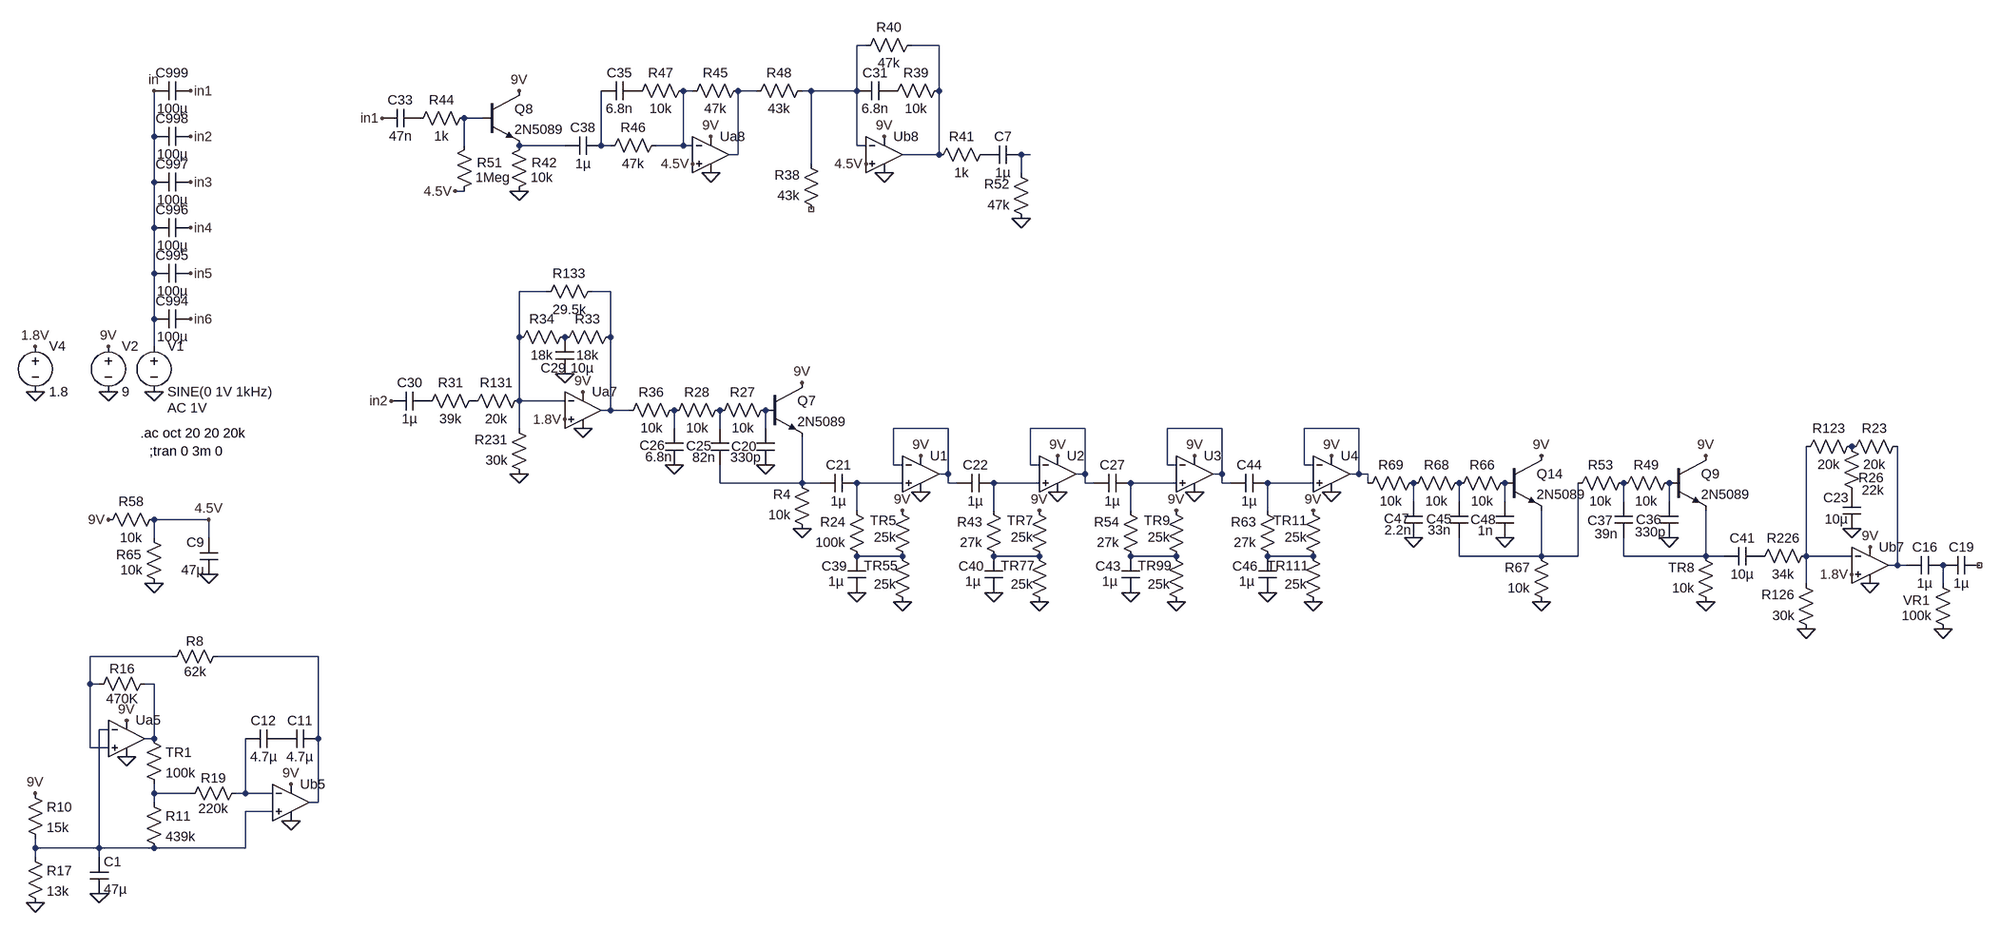
[diagram p0: schematic carbon_copy.asc]
carbon_copy.asc, the LTspice schematic file:
Version 4
SHEET 1 3200 3556
WIRE -320 544 -336 544
WIRE -192 544 -240 544
WIRE -624 624 -640 624
WIRE -512 624 -544 624
WIRE -416 624 -432 624
WIRE -336 624 -336 544
WIRE -336 624 -416 624
WIRE -192 624 -192 544
WIRE -992 672 -1024 672
WIRE -1568 704 -1568 624
WIRE -1024 720 -1024 672
WIRE -848 720 -928 720
WIRE -784 720 -784 624
WIRE -768 720 -784 720
WIRE -640 720 -640 624
WIRE -640 720 -688 720
WIRE -624 720 -640 720
WIRE -336 720 -336 624
WIRE -320 720 -336 720
WIRE -544 736 -544 624
WIRE -544 736 -560 736
WIRE -192 736 -192 624
WIRE -192 736 -256 736
WIRE -32 736 -48 736
WIRE -416 752 -416 624
WIRE -48 768 -48 736
WIRE -1568 784 -1568 704
WIRE -1024 800 -1040 800
WIRE -1568 864 -1568 784
WIRE -1568 944 -1568 864
WIRE -880 976 -928 976
WIRE -768 976 -800 976
WIRE -1568 1024 -1568 944
WIRE -928 1056 -928 976
WIRE -768 1056 -768 976
WIRE -1568 1072 -1568 1024
WIRE -928 1168 -928 1056
WIRE -848 1168 -928 1168
WIRE -768 1184 -768 1056
WIRE -768 1184 -784 1184
WIRE -736 1184 -768 1184
WIRE -928 1216 -928 1168
WIRE -656 1216 -656 1184
WIRE -576 1216 -576 1184
WIRE -496 1216 -496 1184
WIRE -176 1216 -272 1216
WIRE 64 1216 -32 1216
WIRE 304 1216 208 1216
WIRE 544 1216 448 1216
WIRE -272 1280 -272 1216
WIRE -256 1280 -272 1280
WIRE -32 1280 -32 1216
WIRE -16 1280 -32 1280
WIRE 208 1280 208 1216
WIRE 224 1280 208 1280
WIRE 448 1280 448 1216
WIRE 464 1280 448 1280
WIRE -176 1296 -176 1216
WIRE -176 1296 -192 1296
WIRE 64 1296 64 1216
WIRE 64 1296 48 1296
WIRE 304 1296 304 1216
WIRE 304 1296 288 1296
WIRE 544 1296 544 1216
WIRE 544 1296 528 1296
WIRE 560 1296 544 1296
WIRE -576 1312 -576 1280
WIRE -432 1312 -432 1232
WIRE -432 1312 -576 1312
WIRE -400 1312 -432 1312
WIRE -256 1312 -336 1312
WIRE -176 1312 -176 1296
WIRE -160 1312 -176 1312
WIRE -16 1312 -96 1312
WIRE 64 1312 64 1296
WIRE 80 1312 64 1312
WIRE 224 1312 144 1312
WIRE 304 1312 304 1296
WIRE 320 1312 304 1312
WIRE 464 1312 384 1312
WIRE 560 1312 560 1296
WIRE 640 1344 640 1312
WIRE 720 1344 720 1312
WIRE 800 1344 800 1312
WIRE 1008 1344 1008 1312
WIRE 1088 1344 1088 1312
WIRE -336 1360 -336 1312
WIRE -96 1360 -96 1312
WIRE 144 1360 144 1312
WIRE 384 1360 384 1312
WIRE -1472 1376 -1568 1376
WIRE -1568 1408 -1568 1376
WIRE -1472 1408 -1472 1376
WIRE -256 1440 -336 1440
WIRE -16 1440 -96 1440
WIRE 224 1440 144 1440
WIRE 464 1440 384 1440
WIRE 720 1440 720 1408
WIRE 864 1440 864 1360
WIRE 864 1440 720 1440
WIRE 928 1440 928 1312
WIRE 928 1440 864 1440
WIRE 1008 1440 1008 1408
WIRE 1152 1440 1152 1360
WIRE 1152 1440 1008 1440
WIRE 1184 1440 1152 1440
WIRE 1328 1440 1328 1248
WIRE 1408 1440 1328 1440
WIRE 1488 1456 1488 1248
WIRE 1488 1456 1472 1456
WIRE 1504 1456 1488 1456
WIRE 1328 1488 1328 1440
WIRE 1568 1488 1568 1456
WIRE -1536 1616 -1680 1616
WIRE -1280 1616 -1456 1616
WIRE -1680 1664 -1680 1616
WIRE -1664 1664 -1680 1664
WIRE -1568 1664 -1584 1664
WIRE -1648 1744 -1664 1744
WIRE -1568 1760 -1568 1664
WIRE -1568 1760 -1584 1760
WIRE -1280 1760 -1280 1616
WIRE -1680 1776 -1680 1664
WIRE -1648 1776 -1680 1776
WIRE -1568 1856 -1568 1840
WIRE -1504 1856 -1568 1856
WIRE -1408 1856 -1408 1760
WIRE -1408 1856 -1424 1856
WIRE -1360 1856 -1408 1856
WIRE -1568 1872 -1568 1856
WIRE -1280 1872 -1280 1760
WIRE -1280 1872 -1296 1872
WIRE -1360 1888 -1408 1888
WIRE -1776 1952 -1776 1936
WIRE -1664 1952 -1664 1744
WIRE -1664 1952 -1776 1952
WIRE -1568 1952 -1664 1952
WIRE -1408 1952 -1408 1888
WIRE -1408 1952 -1568 1952
WIRE -1776 1968 -1776 1952
WIRE -1664 1968 -1664 1952
FLAG -1568 1152 0
FLAG -1568 624 in
FLAG -1648 1152 0
FLAG -1648 1072 9V
FLAG -1504 624 in1
FLAG -1504 704 in2
FLAG -1504 784 in3
FLAG -1504 864 in4
FLAG -1504 944 in5
FLAG -1504 1024 in6
FLAG -1648 1376 9V
FLAG -1568 1488 0
FLAG -1472 1472 0
FLAG -1472 1376 4.5V
FLAG -1776 2048 0
FLAG -1328 1904 0
FLAG -1616 1792 0
FLAG -1664 2032 0
FLAG -1616 1728 9V
FLAG -1328 1840 9V
FLAG -1776 1856 9V
FLAG -816 1152 9V
FLAG -816 1216 0
FLAG -928 1296 0
FLAG -848 1120 0
FLAG -1776 1152 0
FLAG -1776 1072 1.8V
FLAG -848 1200 1.8V
FLAG -1040 800 4.5V
FLAG -928 800 0
FLAG -928 624 9V
FLAG -624 752 4.5V
FLAG -592 704 9V
FLAG -592 768 0
FLAG -320 752 4.5V
FLAG -288 704 9V
FLAG -288 768 0
FLAG -48 848 0
FLAG -1168 672 in1
FLAG -1152 1168 in2
FLAG -432 1136 9V
FLAG -496 1280 0
FLAG -656 1280 0
FLAG -432 1392 0
FLAG -336 1504 0
FLAG -256 1520 0
FLAG -256 1360 9V
FLAG -224 1328 0
FLAG -224 1264 9V
FLAG -96 1504 0
FLAG -16 1520 0
FLAG -16 1360 9V
FLAG 16 1328 0
FLAG 16 1264 9V
FLAG 144 1504 0
FLAG 224 1520 0
FLAG 224 1360 9V
FLAG 256 1328 0
FLAG 256 1264 9V
FLAG 384 1504 0
FLAG 464 1520 0
FLAG 464 1360 9V
FLAG 496 1328 0
FLAG 496 1264 9V
FLAG 864 1264 9V
FLAG 800 1408 0
FLAG 640 1408 0
FLAG 864 1520 0
FLAG 1152 1264 9V
FLAG 1088 1408 0
FLAG 1152 1520 0
FLAG 1440 1424 9V
FLAG 1440 1488 0
FLAG 1328 1568 0
FLAG 1408 1472 1.8V
FLAG 1408 1392 0
FLAG 1568 1568 0
SYMBOL voltage -1568 1056 R0
WINDOW 123 24 124 Left 2
WINDOW 39 0 0 Left 2
SYMATTR Value2 AC 1V
SYMATTR InstName V1
SYMATTR Value SINE(0 1V 1kHz)
SYMBOL voltage -1648 1056 R0
WINDOW 123 0 0 Left 0
WINDOW 39 0 0 Left 0
SYMATTR InstName V2
SYMATTR Value 9
SYMBOL cap -1504 688 R90
WINDOW 0 0 32 VBottom 2
WINDOW 3 32 32 VTop 2
SYMATTR InstName C998
SYMATTR Value 100µ
SYMBOL cap -1504 768 R90
WINDOW 0 0 32 VBottom 2
WINDOW 3 32 32 VTop 2
SYMATTR InstName C997
SYMATTR Value 100µ
SYMBOL cap -1504 848 R90
WINDOW 0 0 32 VBottom 2
WINDOW 3 32 32 VTop 2
SYMATTR InstName C996
SYMATTR Value 100µ
SYMBOL cap -1504 608 R90
WINDOW 0 0 32 VBottom 2
WINDOW 3 32 32 VTop 2
SYMATTR InstName C999
SYMATTR Value 100µ
SYMBOL cap -1504 928 R90
WINDOW 0 0 32 VBottom 2
WINDOW 3 32 32 VTop 2
SYMATTR InstName C995
SYMATTR Value 100µ
SYMBOL cap -1504 1008 R90
WINDOW 0 0 32 VBottom 2
WINDOW 3 32 32 VTop 2
SYMATTR InstName C994
SYMATTR Value 100µ
SYMBOL res -1552 1360 R90
WINDOW 0 0 56 VBottom 2
WINDOW 3 32 56 VTop 2
SYMATTR InstName R58
SYMATTR Value 10k
SYMBOL res -1552 1504 R180
WINDOW 0 38 66 Left 2
WINDOW 3 36 40 Left 2
SYMATTR InstName R65
SYMATTR Value 10k
SYMBOL cap -1456 1472 R180
WINDOW 0 24 56 Left 2
WINDOW 3 24 8 Left 2
SYMATTR InstName C9
SYMATTR Value 47µ
SYMBOL UniversalOpamp2 -1616 1760 R0
SYMATTR InstName Ua5
SYMATTR SpiceLine ilimit=70m rail=0 Vos=0 phimargin=45
SYMBOL res -1408 1840 R90
WINDOW 0 5 56 VBottom 2
WINDOW 3 27 56 VTop 2
SYMATTR InstName R19
SYMATTR Value 220k
SYMBOL res -1792 1840 R0
SYMATTR InstName R10
SYMATTR Value 15k
SYMBOL res -1792 1952 R0
SYMATTR InstName R17
SYMATTR Value 13k
SYMBOL res -1568 1648 R90
WINDOW 0 5 56 VBottom 2
WINDOW 3 27 56 VTop 2
SYMATTR InstName R16
SYMATTR Value 470K
SYMBOL UniversalOpamp2 -1328 1872 R0
SYMATTR InstName Ub5
SYMATTR SpiceLine ilimit=70m rail=0 Vos=0 phimargin=45
SYMBOL res -1440 1600 R90
WINDOW 0 5 56 VBottom 2
WINDOW 3 27 56 VTop 2
SYMATTR InstName R8
SYMATTR Value 62k
SYMBOL res -1584 1744 R0
SYMATTR InstName TR1
SYMATTR Value 100k
SYMBOL res -1584 1856 R0
SYMATTR InstName R11
SYMATTR Value 439k
SYMBOL cap -1680 2032 M180
WINDOW 0 24 56 Left 2
WINDOW 3 24 8 Left 2
SYMATTR InstName C1
SYMATTR Value 47µ
SYMBOL cap -1280 1744 R90
WINDOW 0 0 32 VBottom 2
WINDOW 3 32 32 VTop 2
SYMATTR InstName C11
SYMATTR Value 4.7µ
SYMBOL cap -1344 1744 R90
WINDOW 0 0 32 VBottom 2
WINDOW 3 32 32 VTop 2
SYMATTR InstName C12
SYMATTR Value 4.7µ
SYMBOL res -1024 1184 R270
WINDOW 0 32 56 VTop 2
WINDOW 3 0 56 VBottom 2
SYMATTR InstName R131
SYMATTR Value 20k
SYMBOL res -912 1312 R180
WINDOW 0 36 76 Left 2
WINDOW 3 36 40 Left 2
SYMATTR InstName R231
SYMATTR Value 30k
SYMBOL Opamps\\UniversalOpamp2 -816 1184 R0
SYMATTR InstName Ua7
SYMBOL cap -1088 1152 R90
WINDOW 0 0 32 VBottom 2
WINDOW 3 32 32 VTop 2
SYMATTR InstName C30
SYMATTR Value 1µ
SYMBOL res -992 1152 R90
WINDOW 0 0 56 VBottom 2
WINDOW 3 32 56 VTop 2
SYMATTR InstName R31
SYMATTR Value 39k
SYMBOL res -832 1040 R90
WINDOW 0 0 56 VBottom 2
WINDOW 3 32 56 VTop 2
SYMATTR InstName R34
SYMATTR Value 18k
SYMBOL res -752 1040 R90
WINDOW 0 0 56 VBottom 2
WINDOW 3 32 56 VTop 2
SYMATTR InstName R33
SYMATTR Value 18k
SYMBOL cap -864 1120 M180
WINDOW 0 -26 10 Left 2
WINDOW 3 26 10 Left 2
SYMATTR InstName C29
SYMATTR Value 10µ
SYMBOL voltage -1776 1056 R0
WINDOW 123 0 0 Left 0
WINDOW 39 0 0 Left 0
SYMATTR InstName V4
SYMATTR Value 1.8
SYMBOL cap -1104 656 R90
WINDOW 0 0 32 VBottom 2
WINDOW 3 32 32 VTop 2
SYMATTR InstName C33
SYMATTR Value 47n
SYMBOL res -1008 656 R90
WINDOW 0 0 56 VBottom 2
WINDOW 3 32 56 VTop 2
SYMATTR InstName R44
SYMATTR Value 1k
SYMBOL res -1040 816 M180
WINDOW 0 38 66 Left 2
WINDOW 3 36 40 Left 2
SYMATTR InstName R51
SYMATTR Value 1Meg
SYMBOL npn -992 624 R0
SYMATTR InstName Q8
SYMATTR Value 2N5089
SYMBOL res -944 816 M180
WINDOW 0 38 66 Left 2
WINDOW 3 36 40 Left 2
SYMATTR InstName R42
SYMATTR Value 10k
SYMBOL cap -784 704 R90
WINDOW 0 0 32 VBottom 2
WINDOW 3 32 32 VTop 2
SYMATTR InstName C38
SYMATTR Value 1µ
SYMBOL res -672 704 R90
WINDOW 0 0 56 VBottom 2
WINDOW 3 32 56 VTop 2
SYMATTR InstName R46
SYMATTR Value 47k
SYMBOL res -624 608 R90
WINDOW 0 0 56 VBottom 2
WINDOW 3 32 56 VTop 2
SYMATTR InstName R47
SYMATTR Value 10k
SYMBOL cap -720 608 R90
WINDOW 0 0 32 VBottom 2
WINDOW 3 32 32 VTop 2
SYMATTR InstName C35
SYMATTR Value 6.8n
SYMBOL Opamps\\UniversalOpamp2 -592 736 R0
SYMATTR InstName Ua8
SYMBOL res -528 608 R90
WINDOW 0 0 56 VBottom 2
WINDOW 3 32 56 VTop 2
SYMATTR InstName R45
SYMATTR Value 47k
SYMBOL res -416 608 R90
WINDOW 0 0 56 VBottom 2
WINDOW 3 32 56 VTop 2
SYMATTR InstName R48
SYMATTR Value 43k
SYMBOL Opamps\\UniversalOpamp2 -288 736 R0
SYMATTR InstName Ub8
SYMBOL res -400 848 R180
WINDOW 0 36 76 Left 2
WINDOW 3 36 40 Left 2
SYMATTR InstName R38
SYMATTR Value 43k
SYMBOL cap -272 608 R90
WINDOW 0 0 32 VBottom 2
WINDOW 3 32 32 VTop 2
SYMATTR InstName C31
SYMATTR Value 6.8n
SYMBOL res -176 608 R90
WINDOW 0 0 56 VBottom 2
WINDOW 3 32 56 VTop 2
SYMATTR InstName R39
SYMATTR Value 10k
SYMBOL res -224 528 R90
WINDOW 0 0 56 VBottom 2
WINDOW 3 32 56 VTop 2
SYMATTR InstName R40
SYMATTR Value 47k
SYMBOL res -96 720 R90
WINDOW 0 0 56 VBottom 2
WINDOW 3 32 56 VTop 2
SYMATTR InstName R41
SYMATTR Value 1k
SYMBOL cap -48 720 R90
WINDOW 0 0 32 VBottom 2
WINDOW 3 32 32 VTop 2
SYMATTR InstName C7
SYMATTR Value 1µ
SYMBOL res -32 864 R180
WINDOW 0 36 76 Left 2
WINDOW 3 36 40 Left 2
SYMATTR InstName R52
SYMATTR Value 47k
SYMBOL res -784 960 R90
WINDOW 0 0 56 VBottom 2
WINDOW 3 32 56 VTop 2
SYMATTR InstName R133
SYMATTR Value 29.5k
SYMBOL res -640 1168 R90
WINDOW 0 0 56 VBottom 2
WINDOW 3 32 56 VTop 2
SYMATTR InstName R36
SYMATTR Value 10k
SYMBOL cap -672 1280 M180
WINDOW 0 -45 34 Left 2
WINDOW 3 -35 14 Left 2
SYMATTR InstName C26
SYMATTR Value 6.8n
SYMBOL res -560 1168 R90
WINDOW 0 0 56 VBottom 2
WINDOW 3 32 56 VTop 2
SYMATTR InstName R28
SYMATTR Value 10k
SYMBOL cap -592 1280 M180
WINDOW 0 -43 33 Left 2
WINDOW 3 -32 13 Left 2
SYMATTR InstName C25
SYMATTR Value 82n
SYMBOL res -480 1168 R90
WINDOW 0 0 56 VBottom 2
WINDOW 3 32 56 VTop 2
SYMATTR InstName R27
SYMATTR Value 10k
SYMBOL cap -512 1280 M180
WINDOW 0 -44 32 Left 2
WINDOW 3 -46 13 Left 2
SYMATTR InstName C20
SYMATTR Value 330p
SYMBOL npn -496 1136 R0
SYMATTR InstName Q7
SYMATTR Value 2N5089
SYMBOL res -416 1408 R180
WINDOW 0 36 76 Left 2
WINDOW 3 36 40 Left 2
SYMATTR InstName R4
SYMATTR Value 10k
SYMBOL cap -336 1296 R90
WINDOW 0 0 32 VBottom 2
WINDOW 3 32 32 VTop 2
SYMATTR InstName C21
SYMATTR Value 1µ
SYMBOL res -320 1456 R180
WINDOW 0 36 76 Left 2
WINDOW 3 36 40 Left 2
SYMATTR InstName R24
SYMATTR Value 100k
SYMBOL cap -352 1504 M180
WINDOW 0 -46 46 Left 2
WINDOW 3 -34 20 Left 2
SYMATTR InstName C39
SYMATTR Value 1µ
SYMBOL res -240 1456 R180
WINDOW 0 27 78 Left 2
WINDOW 3 27 49 Left 2
SYMATTR InstName TR5
SYMATTR Value 25k
SYMBOL res -240 1536 R180
WINDOW 0 24 79 Left 2
WINDOW 3 27 47 Left 2
SYMATTR InstName TR55
SYMATTR Value 25k
SYMBOL Opamps\\UniversalOpamp2 -224 1296 R0
SYMATTR InstName U1
SYMBOL cap -96 1296 R90
WINDOW 0 0 32 VBottom 2
WINDOW 3 32 32 VTop 2
SYMATTR InstName C22
SYMATTR Value 1µ
SYMBOL res -80 1456 R180
WINDOW 0 36 76 Left 2
WINDOW 3 36 40 Left 2
SYMATTR InstName R43
SYMATTR Value 27k
SYMBOL cap -112 1504 M180
WINDOW 0 -46 46 Left 2
WINDOW 3 -34 20 Left 2
SYMATTR InstName C40
SYMATTR Value 1µ
SYMBOL res 0 1456 R180
WINDOW 0 27 78 Left 2
WINDOW 3 27 49 Left 2
SYMATTR InstName TR7
SYMATTR Value 25k
SYMBOL res 0 1536 R180
WINDOW 0 24 79 Left 2
WINDOW 3 27 47 Left 2
SYMATTR InstName TR77
SYMATTR Value 25k
SYMBOL Opamps\\UniversalOpamp2 16 1296 R0
SYMATTR InstName U2
SYMBOL cap 144 1296 R90
WINDOW 0 0 32 VBottom 2
WINDOW 3 32 32 VTop 2
SYMATTR InstName C27
SYMATTR Value 1µ
SYMBOL res 160 1456 R180
WINDOW 0 36 76 Left 2
WINDOW 3 36 40 Left 2
SYMATTR InstName R54
SYMATTR Value 27k
SYMBOL cap 128 1504 M180
WINDOW 0 -46 46 Left 2
WINDOW 3 -34 20 Left 2
SYMATTR InstName C43
SYMATTR Value 1µ
SYMBOL res 240 1456 R180
WINDOW 0 27 78 Left 2
WINDOW 3 27 49 Left 2
SYMATTR InstName TR9
SYMATTR Value 25k
SYMBOL res 240 1536 R180
WINDOW 0 24 79 Left 2
WINDOW 3 27 47 Left 2
SYMATTR InstName TR99
SYMATTR Value 25k
SYMBOL Opamps\\UniversalOpamp2 256 1296 R0
SYMATTR InstName U3
SYMBOL cap 384 1296 R90
WINDOW 0 0 32 VBottom 2
WINDOW 3 32 32 VTop 2
SYMATTR InstName C44
SYMATTR Value 1µ
SYMBOL res 400 1456 R180
WINDOW 0 36 76 Left 2
WINDOW 3 36 40 Left 2
SYMATTR InstName R63
SYMATTR Value 27k
SYMBOL cap 368 1504 M180
WINDOW 0 -46 46 Left 2
WINDOW 3 -34 20 Left 2
SYMATTR InstName C46
SYMATTR Value 1µ
SYMBOL res 480 1456 R180
WINDOW 0 27 78 Left 2
WINDOW 3 27 49 Left 2
SYMATTR InstName TR11
SYMATTR Value 25k
SYMBOL res 480 1536 R180
WINDOW 0 24 79 Left 2
WINDOW 3 27 47 Left 2
SYMATTR InstName TR111
SYMATTR Value 25k
SYMBOL Opamps\\UniversalOpamp2 496 1296 R0
SYMATTR InstName U4
SYMBOL res 656 1296 R90
WINDOW 0 0 56 VBottom 2
WINDOW 3 32 56 VTop 2
SYMATTR InstName R69
SYMATTR Value 10k
SYMBOL cap 624 1408 M180
WINDOW 0 -36 34 Left 2
WINDOW 3 -35 14 Left 2
SYMATTR InstName C47
SYMATTR Value 2.2n
SYMBOL res 736 1296 R90
WINDOW 0 0 56 VBottom 2
WINDOW 3 32 56 VTop 2
SYMATTR InstName R68
SYMATTR Value 10k
SYMBOL cap 704 1408 M180
WINDOW 0 -42 33 Left 2
WINDOW 3 -39 14 Left 2
SYMATTR InstName C45
SYMATTR Value 33n
SYMBOL res 816 1296 R90
WINDOW 0 0 56 VBottom 2
WINDOW 3 32 56 VTop 2
SYMATTR InstName R66
SYMATTR Value 10k
SYMBOL cap 784 1408 M180
WINDOW 0 -44 32 Left 2
WINDOW 3 -32 13 Left 2
SYMATTR InstName C48
SYMATTR Value 1n
SYMBOL npn 800 1264 R0
SYMATTR InstName Q14
SYMATTR Value 2N5089
SYMBOL res 880 1536 R180
WINDOW 0 36 76 Left 2
WINDOW 3 36 40 Left 2
SYMATTR InstName R67
SYMATTR Value 10k
SYMBOL res 1024 1296 R90
WINDOW 0 0 56 VBottom 2
WINDOW 3 32 56 VTop 2
SYMATTR InstName R53
SYMATTR Value 10k
SYMBOL cap 992 1408 M180
WINDOW 0 -47 30 Left 2
WINDOW 3 -35 7 Left 2
SYMATTR InstName C37
SYMATTR Value 39n
SYMBOL res 1104 1296 R90
WINDOW 0 0 56 VBottom 2
WINDOW 3 32 56 VTop 2
SYMATTR InstName R49
SYMATTR Value 10k
SYMBOL cap 1072 1408 M180
WINDOW 0 -42 32 Left 2
WINDOW 3 -44 10 Left 2
SYMATTR InstName C36
SYMATTR Value 330p
SYMBOL npn 1088 1264 R0
SYMATTR InstName Q9
SYMATTR Value 2N5089
SYMBOL res 1168 1536 R180
WINDOW 0 36 76 Left 2
WINDOW 3 36 40 Left 2
SYMATTR InstName TR8
SYMATTR Value 10k
SYMBOL res 1344 1584 R180
WINDOW 0 36 76 Left 2
WINDOW 3 36 40 Left 2
SYMATTR InstName R126
SYMATTR Value 30k
SYMBOL Opamps\\UniversalOpamp2 1440 1456 R0
SYMATTR InstName Ub7
SYMBOL cap 1248 1424 R90
WINDOW 0 0 32 VBottom 2
WINDOW 3 32 32 VTop 2
SYMATTR InstName C41
SYMATTR Value 10µ
SYMBOL res 1344 1424 R90
WINDOW 0 0 56 VBottom 2
WINDOW 3 32 56 VTop 2
SYMATTR InstName R226
SYMATTR Value 34k
SYMBOL res 1504 1232 R90
WINDOW 0 0 56 VBottom 2
WINDOW 3 32 56 VTop 2
SYMATTR InstName R23
SYMATTR Value 20k
SYMBOL cap 1392 1392 M180
WINDOW 0 -34 54 Left 2
WINDOW 3 -31 17 Left 2
SYMATTR InstName C23
SYMATTR Value 10µ
SYMBOL res 1424 1232 R90
WINDOW 0 0 56 VBottom 2
WINDOW 3 32 56 VTop 2
SYMATTR InstName R123
SYMATTR Value 20k
SYMBOL res 1424 1344 R180
WINDOW 0 -40 41 Left 2
WINDOW 3 -41 20 Left 2
SYMATTR InstName R26
SYMATTR Value 22k
SYMBOL cap 1568 1440 R90
WINDOW 0 0 32 VBottom 2
WINDOW 3 32 32 VTop 2
SYMATTR InstName C16
SYMATTR Value 1µ
SYMBOL res 1584 1584 R180
WINDOW 0 39 66 Left 2
WINDOW 3 36 40 Left 2
SYMATTR InstName VR1
SYMATTR Value 100k
SYMBOL cap 1632 1440 R90
WINDOW 0 0 32 VBottom 2
WINDOW 3 32 32 VTop 2
SYMATTR InstName C19
SYMATTR Value 1µ
TEXT -1592 1224 Left 2 !.ac oct 20 20 20k
TEXT -1576 1256 Left 2 !;tran 0 3m 0

The netlist it stands for:
* carbon_copy.asc
V1 in 0 SINE(0 1V 1kHz) AC 1V
V2 9V 0 9
C998 in2 in 100µ
C997 in3 in 100µ
C996 in4 in 100µ
C999 in1 in 100µ
C995 in5 in 100µ
C994 in6 in 100µ
R58 4.5V 9V 10k
R65 0 4.5V 10k
C9 0 4.5V 47µ
XUa5 N037 N040 9V 0 N039 level.2 Avol=1Meg GBW=10Meg Slew=10Meg ilimit=70m rail=0 Vos=0 phimargin=45 en=0 enk=0 in=0 ink=0 Rin=500Meg  ; pins IN+ IN- V+ V- OUT
R19 N042 N041 220k
R10 9V N040 15k
R17 N040 0 13k
R16 N039 N037 470K
XUb5 N040 N042 9V 0 N038 level.2 Avol=1Meg GBW=10Meg Slew=10Meg ilimit=70m rail=0 Vos=0 phimargin=45 en=0 enk=0 in=0 ink=0 Rin=500Meg  ; pins IN+ IN- V+ V- OUT
R8 N038 N037 62k
R§TR1 N039 N041 100k
R11 N041 N040 439k
C1 0 N040 47µ
C11 N038 P001 4.7µ
C12 P001 N042 4.7µ
R131 P002 N009 20k
R231 0 N009 30k
XUa7 1.8V N009 9V 0 N010 level.2 Avol=1Meg GBW=10Meg Slew=10Meg ilimit=25m rail=0 Vos=0 phimargin=45 en=0 enk=0 in=0 ink=0 Rin=500Meg  ; pins IN+ IN- V+ V- OUT
C30 P003 in2 1µ
R31 P002 P003 39k
R34 P004 N009 18k
R33 N010 P004 18k
C29 0 P004 10µ
V4 1.8V 0 1.8
C33 P005 in1 47n
R44 N005 P005 1k
R51 4.5V N005 1Meg
Q8 9V N005 N006 0 2N5089
R42 0 N006 10k
C38 N007 N006 1µ
R46 N003 N007 47k
R47 N003 P006 10k
C35 P006 N007 6.8n
XUa8 4.5V N003 9V 0 N004 level.2 Avol=1Meg GBW=10Meg Slew=10Meg ilimit=25m rail=0 Vos=0 phimargin=45 en=0 enk=0 in=0 ink=0 Rin=500Meg  ; pins IN+ IN- V+ V- OUT
R45 N004 N003 47k
R48 N001 N004 43k
XUb8 4.5V N001 9V 0 N002 level.2 Avol=1Meg GBW=10Meg Slew=10Meg ilimit=25m rail=0 Vos=0 phimargin=45 en=0 enk=0 in=0 ink=0 Rin=500Meg  ; pins IN+ IN- V+ V- OUT
R38 NC_01 N001 43k
C31 P007 N001 6.8n
R39 N002 P007 10k
R40 N002 N001 47k
R41 P008 N002 1k
C7 N008 P008 1µ
R52 0 N008 47k
R133 N010 N009 29.5k
R36 N011 N010 10k
C26 0 N011 6.8n
R28 N012 N011 10k
C25 N018 N012 82n
R27 N013 N012 10k
C20 0 N013 330p
Q7 9V N013 N018 0 2N5089
R4 0 N018 10k
C21 N019 N018 1µ
R24 N028 N019 100k
C39 0 N028 1µ
R§TR5 N028 9V 25k
R§TR55 0 N028 25k
XU1 N019 N014 9V 0 N014 level.2 Avol=1Meg GBW=10Meg Slew=10Meg ilimit=25m rail=0 Vos=0 phimargin=45 en=0 enk=0 in=0 ink=0 Rin=500Meg  ; pins IN+ IN- V+ V- OUT
C22 N020 N014 1µ
R43 N029 N020 27k
C40 0 N029 1µ
R§TR7 N029 9V 25k
R§TR77 0 N029 25k
XU2 N020 N015 9V 0 N015 level.2 Avol=1Meg GBW=10Meg Slew=10Meg ilimit=25m rail=0 Vos=0 phimargin=45 en=0 enk=0 in=0 ink=0 Rin=500Meg  ; pins IN+ IN- V+ V- OUT
C27 N021 N015 1µ
R54 N030 N021 27k
C43 0 N030 1µ
R§TR9 N030 9V 25k
R§TR99 0 N030 25k
XU3 N021 N016 9V 0 N016 level.2 Avol=1Meg GBW=10Meg Slew=10Meg ilimit=25m rail=0 Vos=0 phimargin=45 en=0 enk=0 in=0 ink=0 Rin=500Meg  ; pins IN+ IN- V+ V- OUT
C44 N022 N016 1µ
R63 N031 N022 27k
C46 0 N031 1µ
R§TR11 N031 9V 25k
R§TR111 0 N031 25k
XU4 N022 N017 9V 0 N017 level.2 Avol=1Meg GBW=10Meg Slew=10Meg ilimit=25m rail=0 Vos=0 phimargin=45 en=0 enk=0 in=0 ink=0 Rin=500Meg  ; pins IN+ IN- V+ V- OUT
R69 N023 N017 10k
C47 0 N023 2.2n
R68 N024 N023 10k
C45 N032 N024 33n
R66 N025 N024 10k
C48 0 N025 1n
Q14 9V N025 N032 0 2N5089
R67 0 N032 10k
R53 N026 N032 10k
C37 N033 N026 39n
R49 N027 N026 10k
C36 0 N027 330p
Q9 9V N027 N033 0 2N5089
R§TR8 0 N033 10k
R126 0 N034 30k
XUb7 1.8V N034 9V 0 N035 level.2 Avol=1Meg GBW=10Meg Slew=10Meg ilimit=25m rail=0 Vos=0 phimargin=45 en=0 enk=0 in=0 ink=0 Rin=500Meg  ; pins IN+ IN- V+ V- OUT
C41 P009 N033 10µ
R226 N034 P009 34k
R23 N035 P010 20k
C23 0 P011 10µ
R123 P010 N034 20k
R26 P011 P010 22k
C16 N036 N035 1µ
R§VR1 0 N036 100k
C19 NC_02 N036 1µ
.model NPN NPN
.model PNP PNP
.lib standard.bjt
.ac oct 20 20 20k
;tran 0 3m 0
.lib UniversalOpamps2.sub
.backanno
.end